# Altium schematic sheet IGBT Drive Circuit [NoPCB].SchDoc
size A4; SheetNumber: 3; SheetTotal: 3
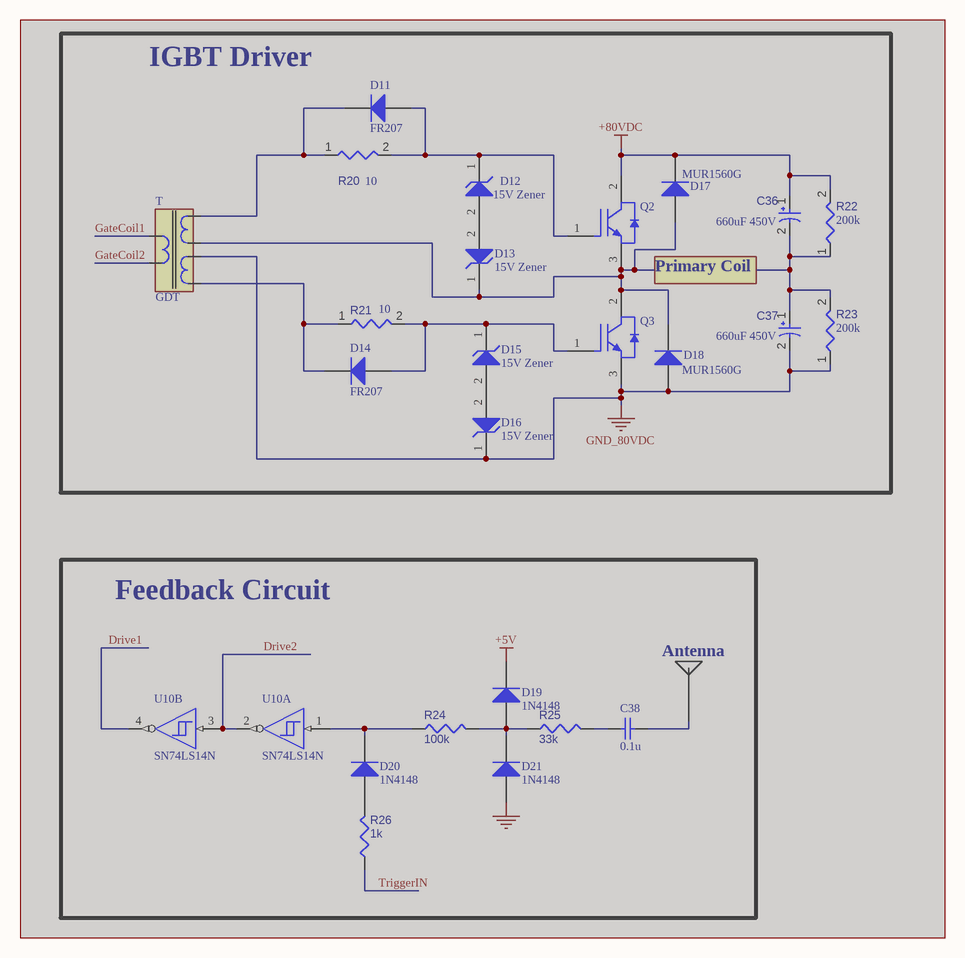
[diagram p0: IGBT Drive Circuit [NoPCB].SchDoc]

## Parts
C36  value 660uF 450V  [SEIK-XH414HG-IV01E_V]  (hidden comment: XH414HG-IV01E)  (masked out: inside a compile mask, not in the netlist)
C37  value 660uF 450V  [SEIK-XH414HG-IV01E_V]  (hidden comment: XH414HG-IV01E)  (masked out: inside a compile mask, not in the netlist)
C38  0.1u  [Ceramic Capacitor THT]  (masked out: inside a compile mask, not in the netlist)
D11  FR207  [NXP-SOD27-2_V]  (masked out: inside a compile mask, not in the netlist)
D12  15V Zener  [ONSC-SMA-2-403D-02_F_V]  (masked out: inside a compile mask, not in the netlist)
D13  15V Zener  [ONSC-SMA-2-403D-02_F_V]  (masked out: inside a compile mask, not in the netlist)
D14  FR207  [NXP-SOD27-2_V]  (masked out: inside a compile mask, not in the netlist)
D15  15V Zener  [ONSC-SMA-2-403D-02_F_V]  (masked out: inside a compile mask, not in the netlist)
D16  15V Zener  [ONSC-SMA-2-403D-02_F_V]  (masked out: inside a compile mask, not in the netlist)
D17  MUR1560G  [NXP-SOD27-2_V]  (masked out: inside a compile mask, not in the netlist)
D18  MUR1560G  [NXP-SOD27-2_V]  (masked out: inside a compile mask, not in the netlist)
D19  1N4148  [Diode]  (masked out: inside a compile mask, not in the netlist)
D20  1N4148  [Diode]  (masked out: inside a compile mask, not in the netlist)
D21  1N4148  [Diode]  (masked out: inside a compile mask, not in the netlist)
Q2  SKW20N60  [INF-PG-TO-247-3]  (value not drawn)  (masked out: inside a compile mask, not in the netlist)
Q3  SKW20N60  [INF-PG-TO-247-3]  (value not drawn)  (masked out: inside a compile mask, not in the netlist)
R20  value 10  [RESC0402(1005)_L]  (hidden comment: 10R2F)  (masked out: inside a compile mask, not in the netlist)
R21  value 10  [RESC0402(1005)_L]  (hidden comment: 10R2F)  (masked out: inside a compile mask, not in the netlist)
R22  value 200k  [RESC0402(1005)_L]  (hidden comment: Resistor 200K +/-1 % 0402 63 mW)  (masked out: inside a compile mask, not in the netlist)
R23  value 200k  [RESC0402(1005)_L]  (hidden comment: Resistor 200K +/-1 % 0402 63 mW)  (masked out: inside a compile mask, not in the netlist)
R24  100k  [RESA60-630X240]  (masked out: inside a compile mask, not in the netlist)
R25  33k  [RESA60-630X240]  (masked out: inside a compile mask, not in the netlist)
R26  1k  [RESA60-630X240]  (masked out: inside a compile mask, not in the netlist)
T  GDT  (masked out: inside a compile mask, not in the netlist)
U10  SN74LS14N  [14PINDIP]  (parts A,B of 7)  (masked out: inside a compile mask, not in the netlist)

## Blocks framed on the sheet
IGBT Driver: C36 C37 D11-D18 Q2 Q3 R20-R23 T
Feedback Circuit: C38 D19-D21 R24-R26 U10

## Notes on the sheet
- Primary Coil
- Antenna

## Library data of the parts
C36 C37 = CMP-001-00052-7: Electric Double Layer Capacitor, 80 mF, 3.3 V, -20 to 60 degC, RoHS; Manufacturer: Seiko Instruments; Voltage Rating: 3.3V; Capacitor Type: Electrolytic; Mounting Technology: SM; Package Reference: XH414HG-IV01E; Pins: 2; Package Description: 2-Pin Surface Mount Device, Diameter 4.8 mm; RoHS Compliant: True; Case/Package: XH414HG-IV01E; Manufacturer URL: http://www.sii.co.jp/en/; Datasheet Version: 39814; Datasheet URL: http://media.digikey.com/pdf/Data%20Sheets/Seiko%20Instruments%20PDFs/XH414HG,%20XH409HG.pdf; Max Operating Temperature: 60°C; Min Operating Temperature: -20°C
C38 = 0.1u 104 Ceramic Capacitor: Ceramic Capacitor, 100 nF, +/- 10%, 50 V, -55 to 125 degC, 2-Pin THD, RoHS, Tape and Reel; Manufacturer: Vishay; Other Names: BC1084CT; Catalog Drawings: Mono-KapSide2-15_5.58Mono-KapSide1_15; Temperature Coefficient: X7R; Voltage - Rated: 50V; Online Catalog: Mono-Kap™Series; Capacitance: 0.1µF; Size / Dimension: 0.157"Lx0.098"W(4.00mmx2.50mm); Operating Temperature: -55°C~125°C; Family: CeramicCapacitors; Manufacturer URL: http://www.vishay.com/; Standard Package: 1; Thickness (Max): -; Ratings: -; Datasheet Version: 08/2013; Package Description: 2-Pin Through Hole Device, Body 4 x 2.6 mm; Mounting Type: ThroughHole; Features: -; Lead Spacing: 0.098"(2.50mm); Tolerance: ±10%; Category: Capacitors; Mounting Technology: ThroughHole; Lead Style: Straight; Datasheet URL: http://www.vishay.com/docs/45171/kseries.pdf; Applications: GeneralPurpose; Package / Case: Radial; Height - Seated (Max): 0.220"(5.58mm); Package Reference: K104K15X7RF5TL2; Series: Mono-Kap™K; Packaging: CutTape(CT)
D11 D14 D17 D18 = CMP-004-00000-2: High Speed Diode, 100 V, 0.45 A, -65 to 175 degC, 2-Pin SOD27, RoHS, Bulk; Manufacturer: Fairchild; Elements: 1; Recovery Time: 4ns; Forward Current: 300mA; Power: 500mW; Forward Voltage: 1V; Max Surge Current: 4A; Peak Reverse Current: 5uA; Datasheet URL: http://www.nxp.com/documents/data_sheet/1N4148_1N4448.pdf; Min Operating Temperature: -65°C; Manufacturer URL: https://www.fairchildsemi.com/; Packaging: Bulk; Diameter: 1.91mm; Pins: 2; Package URL: http://www.nxp.com/documents/data_sheet/1N4148_1N4448.pdf; Package Reference: SOD27; Max Operating Temperature: 175°C; Package Quantity: 2000; Case/Package: DO; Datasheet Version: Aug-04; RoHS Compliant: True
D12 D13 D15 D16 = CMP-1060-00072-1: 1.5 W Zener Voltage Regulator, 2-Pin SMA, Pb-Free, Tape and Reel; Manufacturer: On Semiconductor; PartNumber: 1SMA5919BT3G; VZ Typ (V): 5.6; PackageReference: SMA-2-403D-02_F; ComponentLink3URL: http://www.onsemi.com/pub_link/Collateral/1SMA5913BT3-D.PDF; Mounting Technology: Surface Mount; ComponentLink2URL: http://www.onsemi.com/pub_link/Collateral/1SMA5913BT3-D.PDF; ComponentLink1URL: http://www.onsemi.com/; RoHS: Pb-Free; ComponentLink2Description: Datasheet; ComponentLink3Description: Package Specification; PackageVersion: Rev. F, 11/2008; ComponentLink1Description: Manufacturer URL; PackageDescription: 2-Pin Small Molded Package, J-Bend Lead, Body 2.605 x 4.315 mm; Packing: Tape and Reel; DatasheetVersion: Rev. 8
D19-D21 = 1N4148: High Speed Diode, 100 V, 0.45 A, -65 to 175 degC, 2-Pin SOD27, RoHS, Bulk; Manufacturer: Fairchild; Elements: 1; Recovery Time: 4ns; Forward Current: 300mA; Power: 500mW; Forward Voltage: 1V; Max Surge Current: 4A; Peak Reverse Current: 5uA; Datasheet URL: http://www.nxp.com/documents/data_sheet/1N4148_1N4448.pdf; Min Operating Temperature: -65°C; Manufacturer URL: https://www.fairchildsemi.com/; Packaging: Bulk; Diameter: 1.91mm; Pins: 2; Package URL: http://www.nxp.com/documents/data_sheet/1N4148_1N4448.pdf; Package Reference: SOD27; Max Operating Temperature: 175°C; Package Quantity: 2000; Case/Package: DO; Datasheet Version: Aug-04; RoHS Compliant: True
Q2 Q3 = CMP-1166-00034-1: Fast IGBT in NPT-Technology with Soft, Fast Recovery Anti-Parallel EmCon Diode, PG-TO-247-3, Tube, Green; Manufacturer: Infineon; IC(max) @ 100 degC: 20 A; VCE(sat) (typ): 2.4 V; VCE (max): 600 V; IC(max) @ 25 degC: 40 A; Green: TRUE; Switching Frequency: Fast IGBT 10-40 kHz; PackageVersion: Rev. 03, 12/2007; PackageDescription: 3-Pin Plastic (Green) Transistor Single Outline Package, 15.865 x 5.03 mm Body, 5.44 mm Pitch; Packing: Tube; Mounting Technology: Through Hole; DatasheetVersion: Rev. 2.2; ComponentLink3URL: http://www.infineon.com/dgdl/SKW30N60HS_Rev2_2G.pdf?folderId=db3a304412b407950112b408e8c90004&fileId=db3a304412b407950112b42862d43de6; Halogen-free: FALSE; ComponentLink2URL: http://www.infineon.com/dgdl/SKW20N60_Rev2_2G.pdf?folderId=db3a304412b407950112b408e8c90004&fileId=db3a304412b407950112b427eb2b3d1a; ComponentLink1Description: Manufacturer URL; RevisionNote: Lost Devices pt2; ComponentLink3Description: Package Specification; ComponentLink1URL: http://www.infineon.com/; PartNumber: SKW20N60; PackageReference: PG-TO247-3; ComponentLink2Description: Datasheet
R20 R21 = CMP-009-00067-2: 10R 0.063W 1% 0402 (1005 Metric)  SMD; Power: 63mW; Case/Package: 0402; Tolerance: 1%; Mounting Technology: SMT; Pins: 2
R22 R23 = CMP-009-00163-3: Chip Resistor, 200 kOhms, +/-1 %, 63 mW, -55 to 155 degC, 0402; Power: 63mW; Tolerance: 1%; Min Operating Temperature: -55°C; Max Operating Temperature: 155°C; Case/Package: 0402; Pins: 2
R24 R25 = 10k: Axial Resistor, 10 KOhm, +/- 1%, 250 mW, -55 to 155 degC, 2-Pin THD, RoHS, Bulk
R26 = 1k MFR-25FBF52-1K: Axial Resistor, 1 KOhm, +/- 1%, 250 mW, -55 to 155 degC, 2-Pin THD, RoHS, Bulk
U10 = 74LS14: Hex schmitt-trigger inverters, N0014A, TUBE; Manufacturer: Texas Instruments; F @ Nom Voltage(Max)(Mhz): 35; Input Type: TTL; Technology Family: LS; Bits(#): 6; Output Drive (IOL/IOH)(Max)(mA): -0.4/8; ICC @ Nom Voltage(Max)(mA): 0.06; VCC(Min)(V): 4.75; Voltage(Nom)(V): 5; tpd @ Nom Voltage(Max)(ns): 22; Schmitt Trigger: Yes; VCC(Max)(V): 5.25; Rating: Catalog; Output Type: CMOS; PackageReference: N0014A; DatasheetVersion: SDLS049B; Code_JEDEC: MS-001; Generic Part Number: SN74LS14; Operating Temperature Range(C): 0 to 70